# EAGLE design breadduino (EAGLE 5.06)
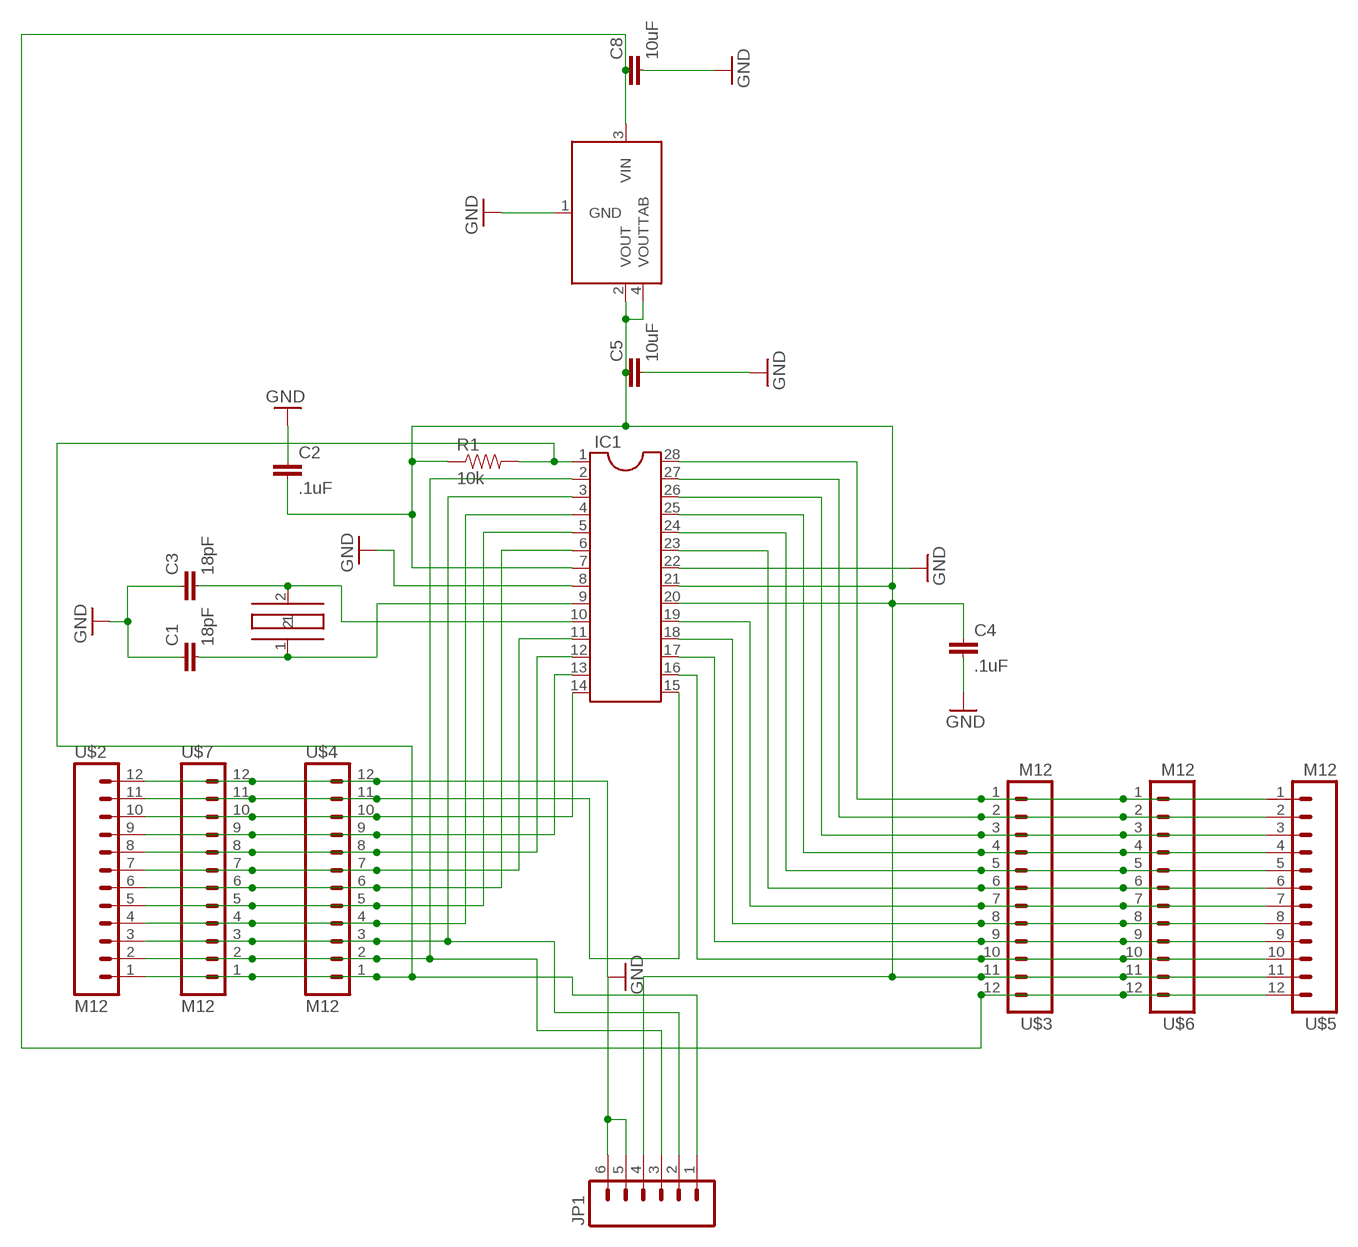
[diagram p0: schematic, sheet 1]

## Parts
5V  ZLDO1117  [ZLDO1117]
C1  18pF  CAP0603-CAP  [0603-CAP]
C2  .1uF  CAP0805  [0805]
C3  18pF  CAP0603-CAP  [0603-CAP]
C4  .1uF  CAP0805  [0805]
C5  10uF  CAP0805  [0805]
C8  10uF  CAP0805  [0805]
IC1  DIL28-3  [DIL28-3]
JP1  M06LOCK  [1X06_LOCK]
R1  10k  RESISTOR  [0805]
U$1  HC49US  [HC49US]
U$2  M12  M12LOCK_NOSCREEN  [1X12_LOCK_NOSCREEN]
U$3  M12  M12LOCK_NOSCREEN  [1X12_LOCK_NOSCREEN]
U$4  M12  M12LOCK_NOSCREEN  [1X12_LOCK_NOSCREEN]
U$5  M12  M12LOCK_NOSCREEN  [1X12_LOCK_NOSCREEN]
U$6  M12  M12LOCK_NOSCREEN  [1X12_LOCK_NOSCREEN]
U$7  M12  M12LOCK_NOSCREEN  [1X12_LOCK_NOSCREEN]

## Nets
5V: 5V.2(VOUT) 5V.4(VOUTTAB) C2.2 C4.1 C5.1 IC1.7 IC1.20 IC1.21 JP1.4 R1.1 U$3.11 U$5.11 U$6.11
A0: IC1.23 U$3.6 U$5.6 U$6.6
A1: IC1.24 U$3.5 U$5.5 U$6.5
A2: IC1.25 U$3.4 U$5.4 U$6.4
A3: IC1.26 U$3.3 U$5.3 U$6.3
A4: IC1.27 U$3.2 U$5.2 U$6.2
A5: IC1.28 U$3.1 U$5.1 U$6.1
D0: IC1.2 JP1.3 U$2.2 U$4.2 U$7.2
D1: IC1.3 JP1.2 U$2.3 U$4.3 U$7.3
D2: IC1.4 U$2.4 U$4.4 U$7.4
D3: IC1.5 U$2.5 U$4.5 U$7.5
D4: IC1.6 U$2.6 U$4.6 U$7.6
D5: IC1.11 U$2.7 U$4.7 U$7.7
D6: IC1.12 U$2.8 U$4.8 U$7.8
D7: IC1.13 U$2.9 U$4.9 U$7.9
D8: IC1.14 U$2.10 U$4.10 U$7.10
D9: IC1.15 U$2.11 U$4.11 U$7.11
D10: IC1.16 U$3.10 U$5.10 U$6.10
D11: IC1.17 U$3.9 U$5.9 U$6.9
D12: IC1.18 U$3.8 U$5.8 U$6.8
D13: IC1.19 U$3.7 U$5.7 U$6.7
GND: 5V.1(GND) C1.1 C2.1 C3.1 C4.2 C5.2 C8.2 IC1.8 IC1.22 JP1.5 JP1.6 U$2.12 U$4.12 U$7.12
N$1: C3.2 IC1.10 U$1.2
N$3: C1.2 IC1.9 U$1.1
RESET: IC1.1 JP1.1 R1.2 U$2.1 U$4.1 U$7.1
VIN: 5V.3(VIN) C8.1 U$3.12 U$5.12 U$6.12

## Library data of the parts
5V = 1dah:ZLDO1117
C1-C5 C8 = 1dah:CAP: Capacitor Standard 0603 ceramic capacitor, and 0.1" leaded capacitor.
IC1 = 1dah:DIL28: Dual In Line
JP1 = 1dah:M06: Header 6 Standard 6-pin 0.1" header. Use with straight break away headers (SKU : PRT-00116), right angle break away headers (PRT-00553), swiss pins (PRT-00743), machine pins (PRT-00117), and female headers (PRT-00115). Molex polarized connector foot print use with SKU : PRT-08094 with associated crimp pins and housings. NOTES ON THE VARIANTS LOCK and LOCK_LONGPADS... This footprint was designed to help hold the alignment of a through-hole component (i.e. 6-pin header) while soldering it into place. You may notice that each hole has been shifted either up or down by 0.005 of an inch from it's more standard position (which is a perfectly straight line). This slight alteration caused the pins (the squares in the middle) to touch the edges of the holes. Because they are alternating, it causes a "brace" to hold the component in place. 0.005 has proven to be the perfect amount of "off-center" position when using our standard breakaway headers. Although looks a little odd when you look at the bare footprint, once you have a header in there, the alteration is very hard to notice. Also, if you push a header all the way into place, it is covered up entirely on the bottom side. This idea of altering the position of holes to aid alignment will be further integrated into the Sparkfun Library for other footprints. It can help hold any component with 3 or more connection pins.
R1 = 1dah:RESISTOR: Resistor Basic schematic elements and footprints for 0603, 1206, and PTH 1/10th watt (small) resistors.
U$1 = 1dah:HC49US: 16 MHz crystal
U$2-U$7 = 1dah:M12: Header 12 Standard 12-pin 0.1" header. Use with straight break away headers (SKU : PRT-00116), right angle break away headers (PRT-00553), swiss pins (PRT-00743), machine pins (PRT-00117), and female headers (PRT-00115).

## Board
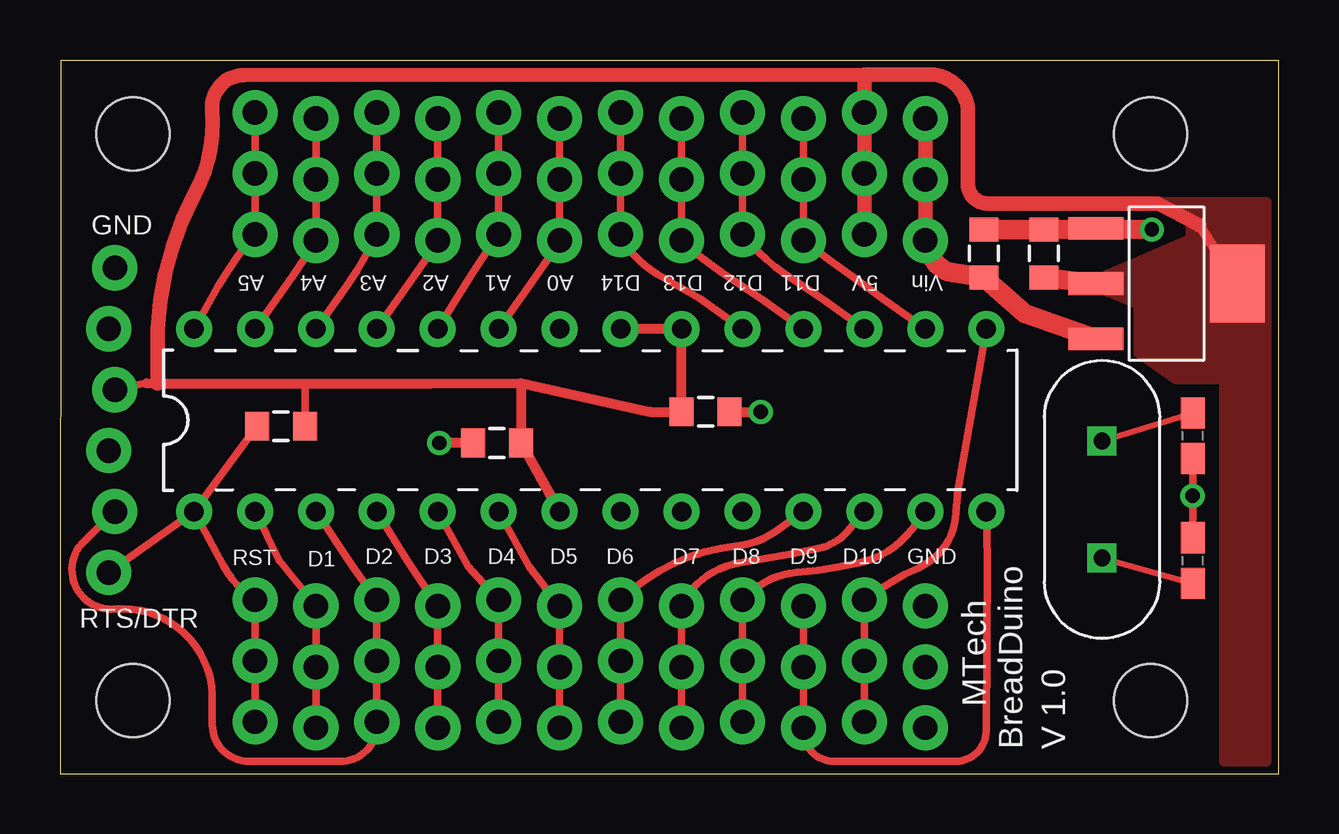
[diagram p1: board, top side]
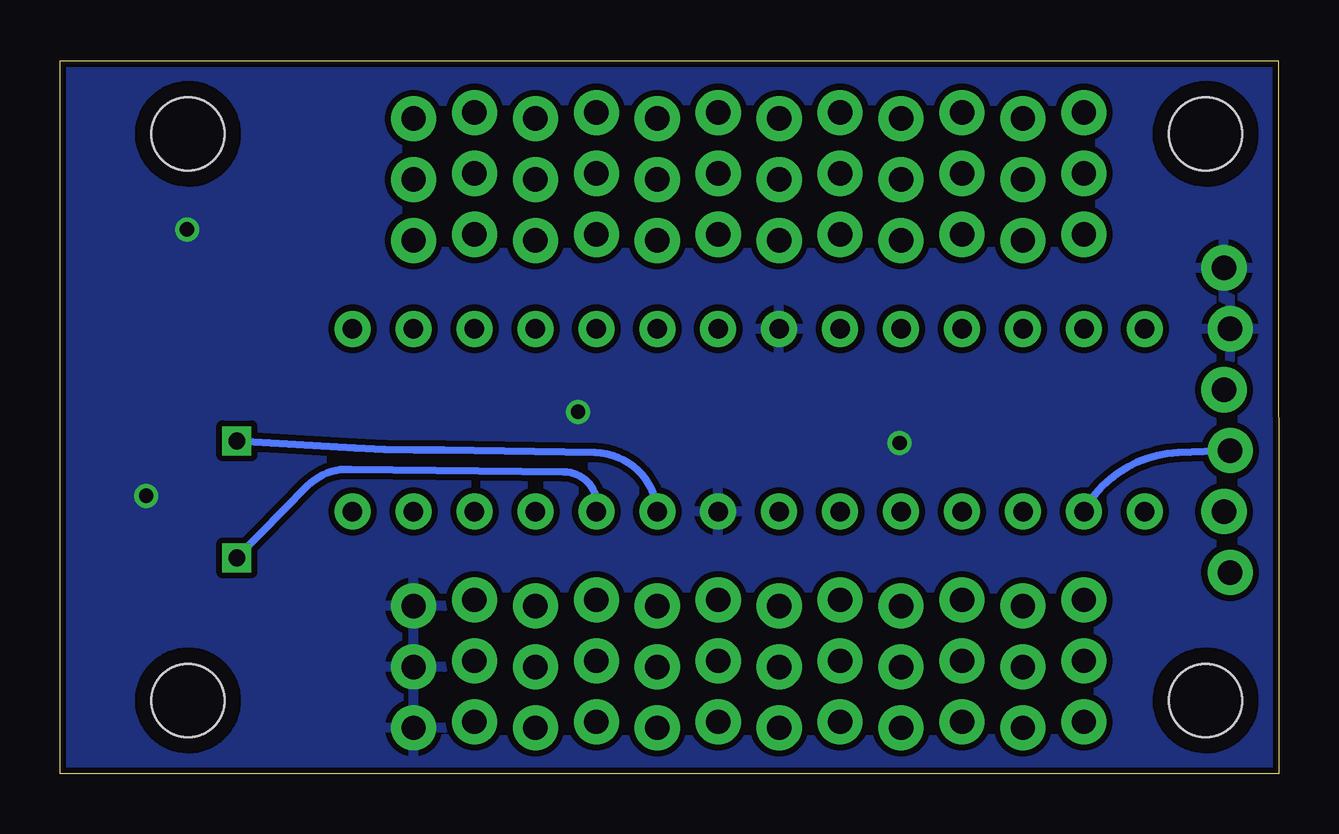
[diagram p2: board, bottom side, seen from below]

Size 50.81 x 29.72 mm. Coordinates in mm from the lower left corner, seen from the top.
Outline: 0,0 50.8,0 50.8,29.72 0.03,29.72 0,0
Copper layers (1*16): Top 0.0356mm / dielectric 1.5011mm / Bottom 0.0356mm
Design rules "goldenpcb": minimum track width 9mil, minimum drill 18mil, track to track 9mil, track to pad 9mil, pad to pad 9mil, via to via 9mil, smd to smd 9mil, copper to edge 10mil, drill to drill 9mil, minimum pad ring 10mil, minimum via ring 8mil, stop-mask expansion 4mil, vias tented up to drill 25mil, thermal gap 10mil

### Footprints (pad centres in the part's own frame; a part is rotated, then mirrored left to right if it is on the bottom)
ZLDO1117 = smd 0.95 x 2.3: 1 -2.3,-3; 2 0,-3; 3 2.3,-3 | smd 3.25 x 2.3: 4 0,2.9
0603-CAP = smd 1.3 x 1: 1 -0.95,0; 2 0.95,0
0805 = smd 1 x 1.2: 1 -1,0; 2 1,0
DIL28-3 = drill 0.813 pad 1.5 round: 1 -16.51,-3.81; 2 -13.97,-3.81; 3 -11.43,-3.81; 4 -8.89,-3.81; 5 -6.35,-3.81; 6 -3.81,-3.81; 7 -1.27,-3.81; 8 1.27,-3.81; 9 3.81,-3.81; 10 6.35,-3.81; 11 8.89,-3.81; 12 11.43,-3.81; 13 13.97,-3.81; 14 16.51,-3.81; 15 16.51,3.81; 16 13.97,3.81; 17 11.43,3.81; 18 8.89,3.81; 19 6.35,3.81; 20 3.81,3.81; 21 1.27,3.81; 22 -1.27,3.81; 23 -3.81,3.81; 24 -6.35,3.81; 25 -8.89,3.81; 26 -11.43,3.81; 27 -13.97,3.81; 28 -16.51,3.81
1X06_LOCK = drill 1.016 pad 1.88 round: 1 0,0; 2 2.54,-0.254; 3 5.08,0; 4 7.62,-0.254; 5 10.16,0; 6 12.7,-0.254
HC49US = drill 0.7 square: 1 -2.44,0; 2 2.44,0
1X12_LOCK_NOSCREEN = drill 1.016 pad 1.88 round: 1 0,0.127; 2 2.54,-0.127; 3 5.08,0.127; 4 7.62,-0.127; 5 10.16,0.127; 6 12.7,-0.127; 7 15.24,0.127; 8 17.78,-0.127; 9 20.32,0.127; 10 22.86,-0.127; 11 25.4,0.127; 12 27.94,-0.127
STAND-OFF-TIGHT = hole 3.048: 0,0

### Placement (x,y rotation side)
5V  46.17,20.43 270 top
C1  47.21,14.08 90 top
C2  26.91,15.08 180 top
C3  47.21,8.88 270 top
C4  18.21,13.78 180 top
C5  41.01,21.68 90 top
C8  38.51,21.68 90 top
IC1  22.1,14.73 0 top
JP1  2.03,8.38 90 top
R1  9.21,14.48 180 top
U$1  43.43,11.43 270 top
U$2  8.13,7.11 0 top
U$3  8.13,24.89 0 top
U$4  8.13,4.57 0 top
U$5  8.13,22.35 0 top
U$6  8.13,27.43 0 top
U$7  8.13,2.03 0 top
U$8  [STAND-OFF-TIGHT]  3.05,26.67 0 top
U$9  [STAND-OFF-TIGHT]  3.05,3.05 0 top
U$10  [STAND-OFF-TIGHT]  45.47,26.67 0 top
U$11  [STAND-OFF-TIGHT]  45.47,3.05 0 top

### Tracks (layer width: path | path; a pad name or v marks a point on that pad's centre or on a via)
5V
  Top 0.305: 10.21,16.26 R1.1 | JP1.4 3.6,16.28
  Top 0.406: 19.21,16.28 15.44,16.26 10.21,16.26 4.06,16.26 3.6,16.28 | 19.21,16.28 C4.1 IC1.7 | IC1.21 IC1.20 C2.2 24.61,15.08 19.21,16.28 | 47.5,22.86 5V.4
  Top 0.61: 4.06,16.26 4.06,18.54 arc-24 5.59,24.13 arc34 6.35,27.69 arc-95 7.66,29.12 33.53,29.13 | 47.5,22.86 45.77,23.77 38.65,23.77 arc-94 37.85,24.64 37.85,27.43 arc99 36.13,29.14 33.53,29.13 | U$5.11 U$3.11 U$6.11 33.53,29.13
  Top 0.813: C5.1 5V.2
  pour Top (no thermals): 44.96,21.34 43.69,20.83 43.69,20.07 44.96,19.56 44.96,17.53 46.48,16.46 48.51,16.46 48.51,0.51 50.29,0.51 50.3,23.83 45.46,23.83 47.11,23.08 47.11,22.28
A0
  Top 0.305: IC1.23 19.56,20.32 arc4 U$5.6 U$3.6 U$6.6
A1
  Top 0.305: IC1.24 17.02,20.57 arc-3 U$5.5 U$3.5 U$6.5
A2
  Top 0.305: IC1.25 14.48,20.32 arc4 U$5.4 U$3.4 U$6.4
A3
  Top 0.305: IC1.26 11.94,20.32 arc10 U$5.3 U$3.3 U$6.3
A4
  Top 0.305: IC1.27 9.4,20.32 arc4 U$5.2 U$3.2 U$6.2
A5
  Top 0.305: IC1.28 6.6,20.32 arc-11 U$5.1 U$3.1 U$6.1
D0
  Top 0.305: IC1.2 9.14,8.89 U$2.2 U$4.2 U$7.2
  Bottom 0.305: JP1.3 4.2,13.38 arc-60 IC1.2
D1
  Top 0.305: IC1.3 12.19,8.64 U$2.3 U$4.3 U$7.3 arc-95 11.68,0.51 7.87,0.51 arc-90 6.35,2.03 6.35,3.3 arc92 2.29,6.86 arc-141 1,9.68 JP1.2
D2
  Top 0.305: IC1.4 14.48,8.89 U$2.4 U$4.4 U$7.4
D3
  Top 0.305: IC1.5 17.02,8.64 U$2.5 U$4.5 U$7.5
D4
  Top 0.305: IC1.6 19.56,8.64 U$2.6 U$4.6 U$7.6
D5
  Top 0.305: IC1.11 29.8,10.08 arc-30 28.2,9.48 arc38 U$2.7 U$4.7 U$7.7
D6
  Top 0.305: IC1.12 32.8,10.08 arc-38 31.6,9.38 arc-2 28.3,8.78 arc55 U$2.8 U$4.8 U$7.8
D7
  Top 0.305: IC1.13 35.5,10.18 arc-40 33.3,8.78 arc-7 30.7,8.38 arc44 U$2.9 U$4.9 U$7.9
D8
  Top 0.305: IC1.14 38.65,8.88 38.61,1.78 arc-89 37.34,0.51 arc-1 32.26,0.51 arc-95 U$7.10 U$4.10 U$2.10
D9
  Top 0.305: IC1.15 37.5,12.28 arc8 37.35,10.88 arc-64 35.8,8.58 arc13 U$2.11 U$4.11 U$7.11
D10
  Top 0.305: IC1.16 34.29,19.81 arc-1 U$5.10 U$3.10 U$6.10
D11
  Top 0.305: IC1.17 31.75,19.81 30.23,20.83 arc-18 U$5.9 U$3.9 U$6.9
D12
  Top 0.305: IC1.18 29.21,19.81 27.69,20.83 arc-9 U$5.8 U$3.8 U$6.8
D13
  Top 0.305: IC1.19 26.67,19.81 24.89,20.83 arc-35 U$5.7 U$3.7 U$6.7
GND  (via drill 0.6)
  Top 0.305: C1.1 v47.21,11.58 C3.1
  Top 0.406: C4.2 v15.81,13.78 | C2.1 v29.21,15.08
  Top 0.813: C8.2 C5.2 5V.1 v45.51,22.68
  pour Bottom (isolate 0.254): -5.08,-7.62 62.23,-7.62 62.23,-5.08 62.23,34.29 -5.08,34.29
N$1
  Top 0.254: U$1.2 C3.2
  Bottom 0.305: U$1.2 40.5,11.98 arc49 38.7,12.68 29.8,12.58 arc100 IC1.10
N$3
  Top 0.254: U$1.1 C1.2
  Bottom 0.305: U$1.1 38.5,13.58 arc-4 34.8,13.48 28.5,13.38 arc85 IC1.9
RESET
  Top 0.305: IC1.1 R1.2 | IC1.1 JP1.1 | IC1.1 6.8,8.68 arc29 U$2.1 U$4.1 U$7.1
VIN
  Top 0.61: U$6.12 U$3.12 U$5.12
  Top 0.813: 5V.3 40.21,19.18 C8.1 37.21,20.88 arc-59 36.32,21.59 U$5.12

### Text on the board
tPlace: GND | A5 | A4 | A3 | A2 | A1 | A0 | D14 | D13 | D12 | D11 | 5V | Vin | RST | D1 | D2 | D3 | D4 | D5 | D6 | D7 | D8 | D9 | D10 | GND | RTS/DTR | MTech | BreadDuino | V 1.0